# Altium project SPIDERBOT.PrjPcb
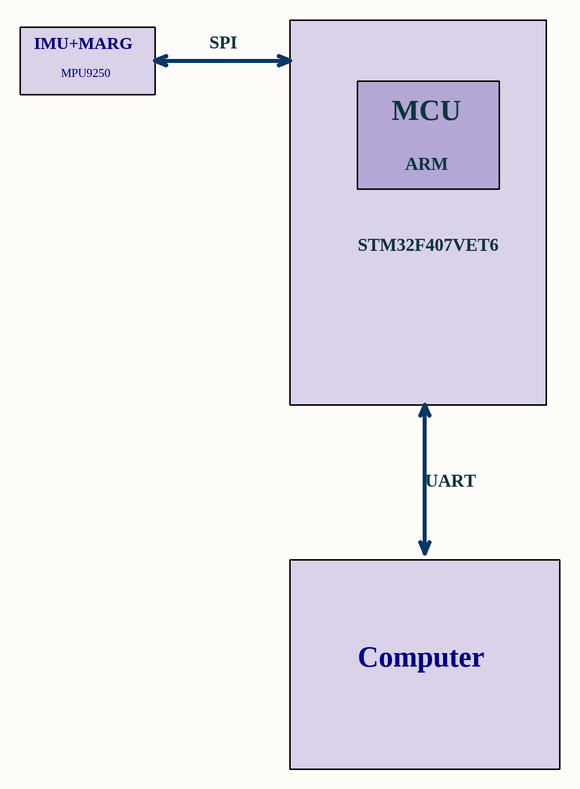
[diagram p0: Block_Diagram.SchDoc]
6 sheets, 25 parts. Net scope: flat (ports and power ports of the same name join across sheets).
Board file: Spiderbot.PcbDoc
Sheets:
  Block_Diagram.SchDoc
  PowerDiagram.SchDoc
  MCU.SchDoc
  PS2.SchDoc
  UART LORA.SchDoc
  Sheet1.SchDoc

## Sheet Block_Diagram.SchDoc
size A; SheetNumber: 1; SheetTotal: 7

### Notes on the sheet
- IMU+MARG
- MPU9250
- SPI
- MCU
- ARM
- STM32F407VET6
- UART
- Computer

## Sheet PowerDiagram.SchDoc
size A; SheetNumber: 2; SheetTotal: 5
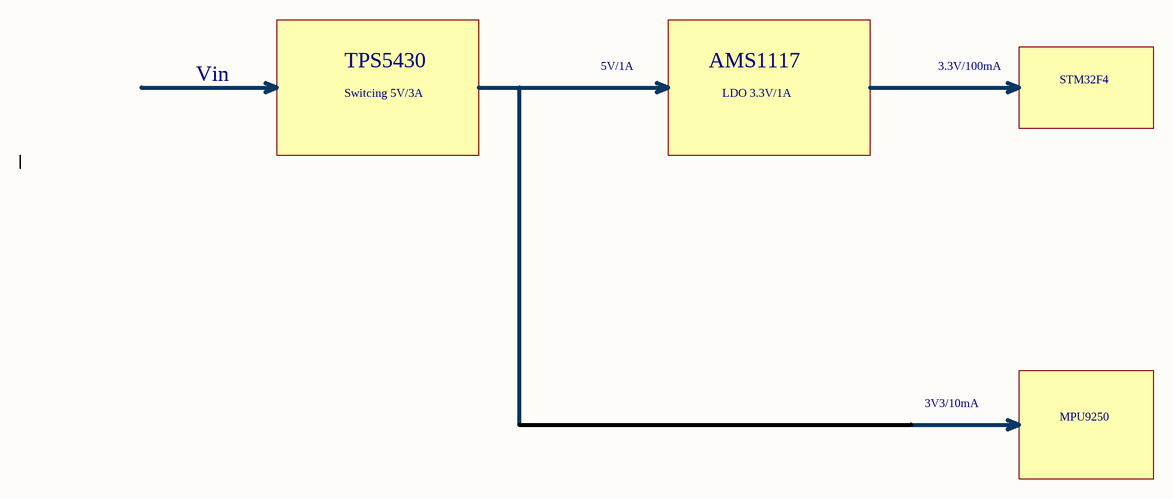
[diagram p1: PowerDiagram.SchDoc]

### Notes on the sheet
- Vin
- TPS5430
- Switcing 5V/3A
- 5V/1A
- AMS1117
- LDO 3.3V/1A
- 3.3V/100mA
- STM32F4
- 3V3/10mA
- MPU9250

## Sheet MCU.SchDoc
size A3; SheetNumber: 4; SheetTotal: 7
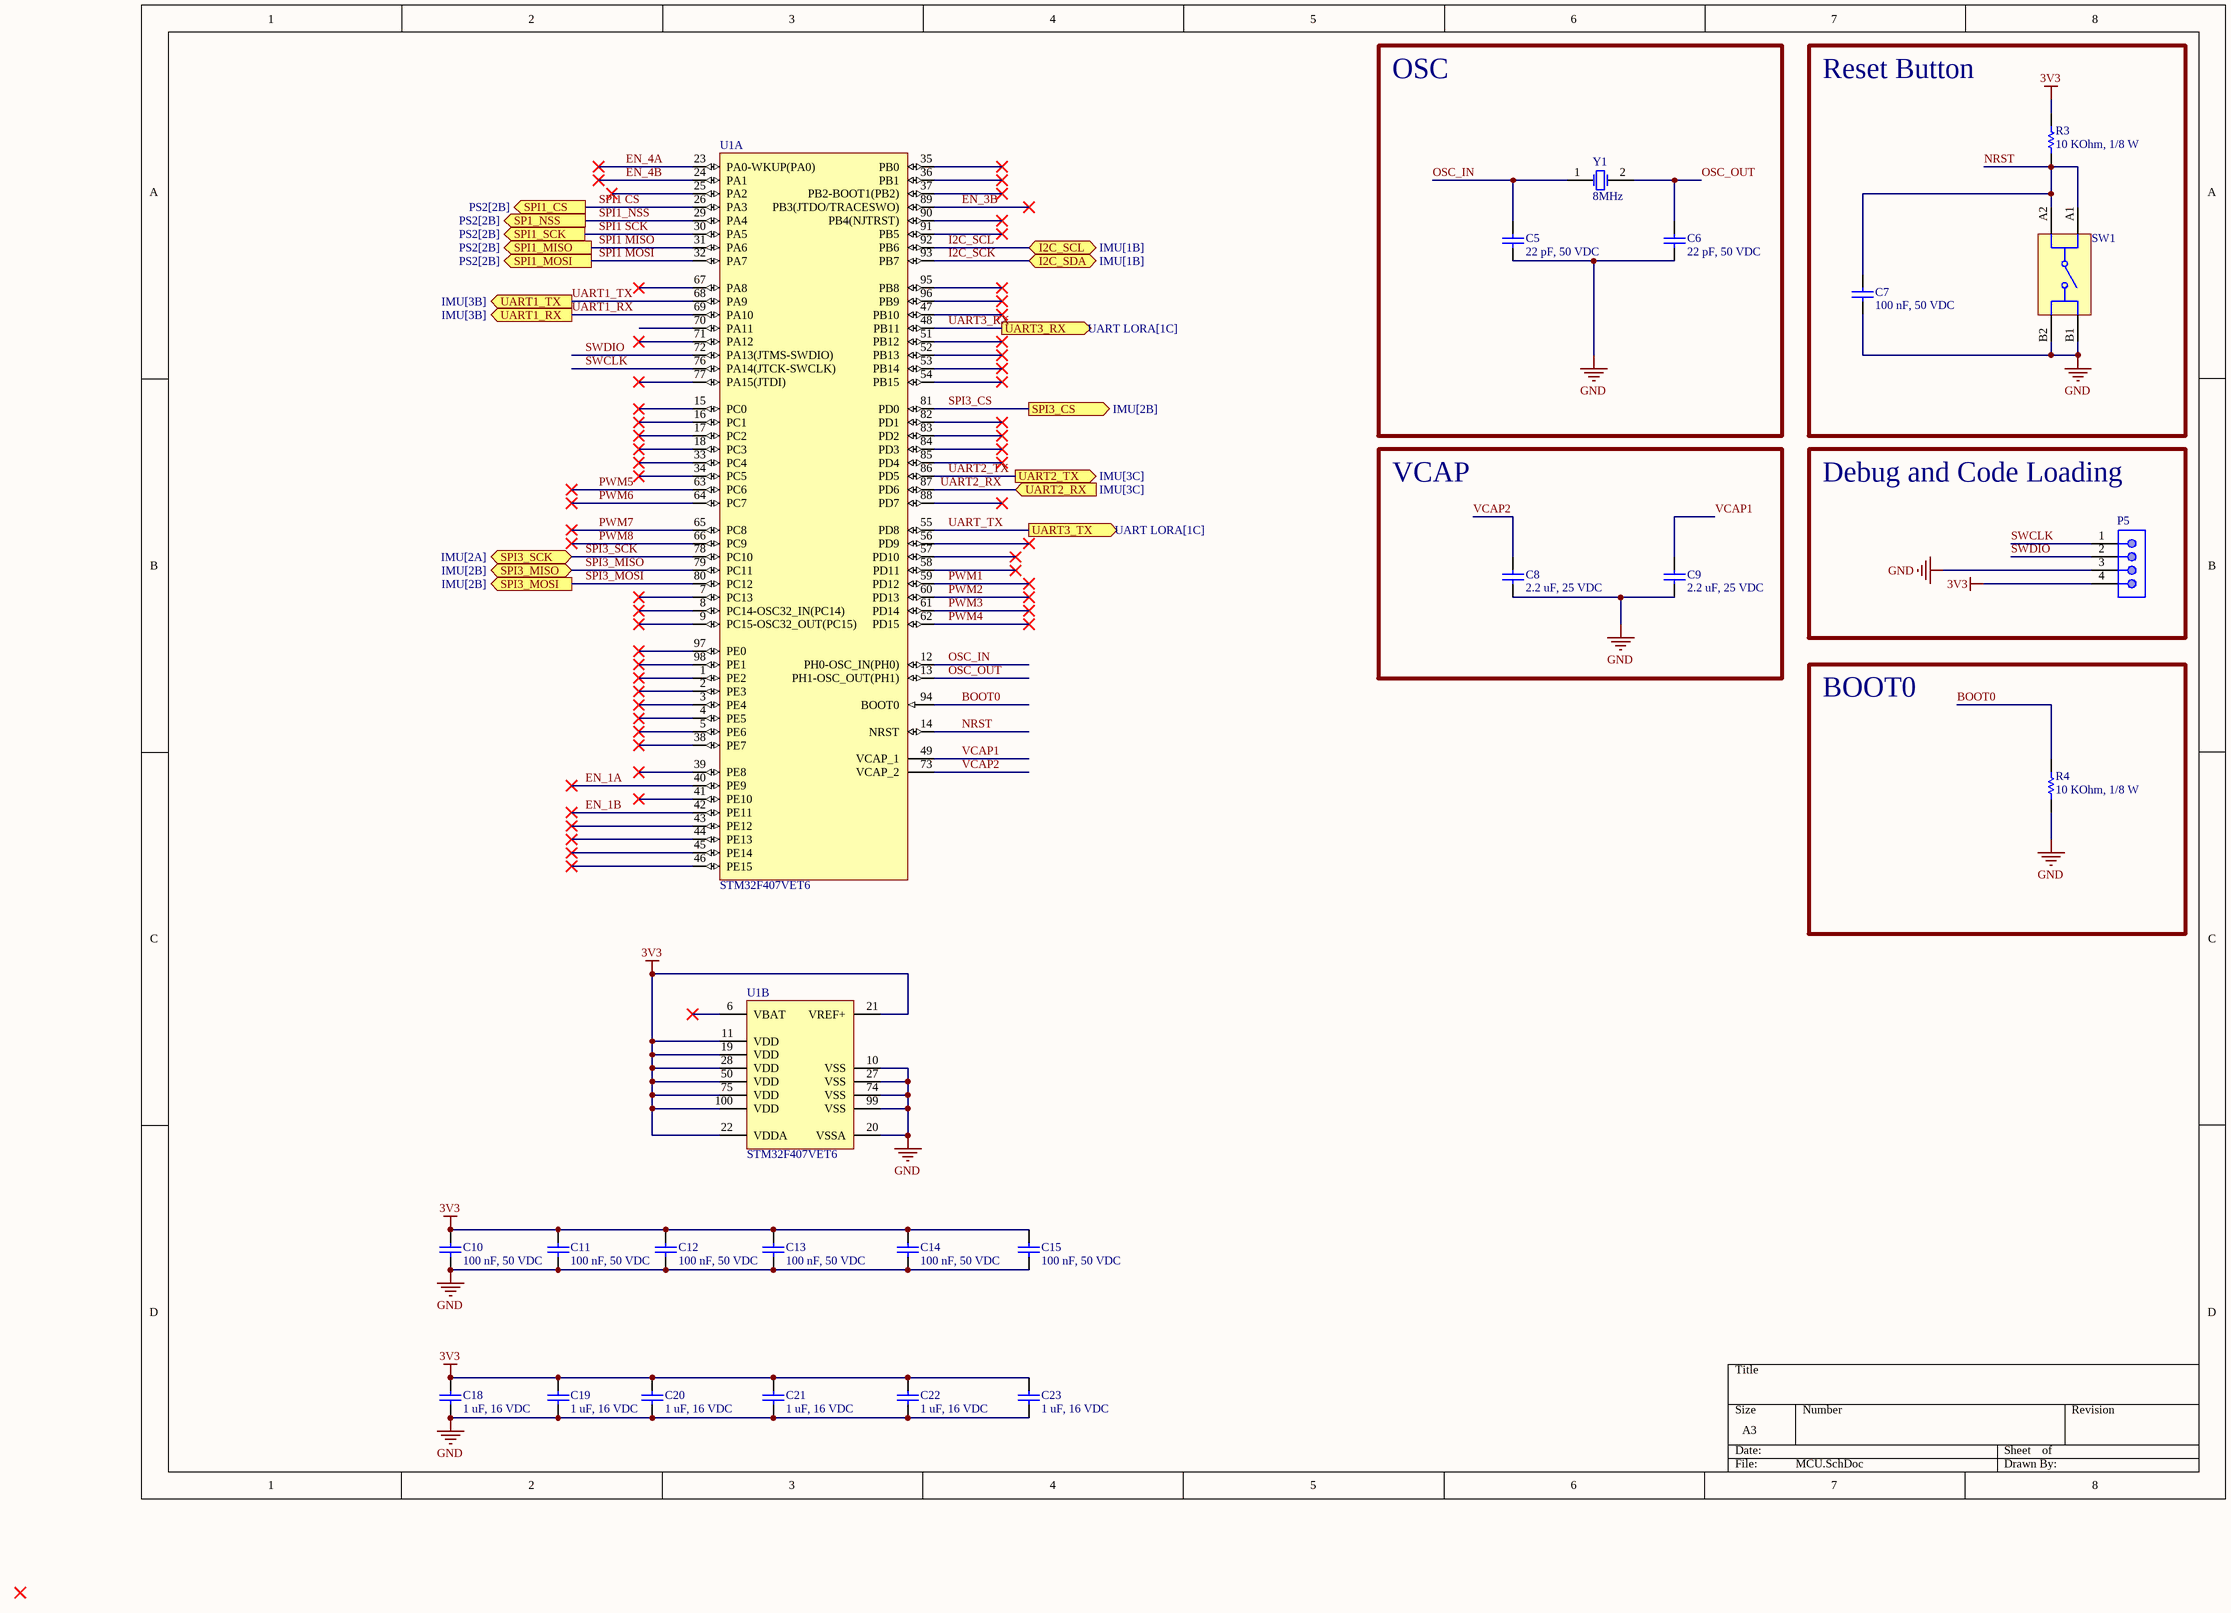
[diagram p2: MCU.SchDoc]

### Parts
C5  22 pF, 50 VDC  [CAP_0805]
C6  22 pF, 50 VDC  [CAP_0805]
C7  100 nF, 50 VDC  [CAP_0805]
C8  2.2 uF, 25 VDC  [CAP_0805]
C9  2.2 uF, 25 VDC  [CAP_0805]
C10  100 nF, 50 VDC  [CAP_0805]
C11  100 nF, 50 VDC  [CAP_0805]
C12  100 nF, 50 VDC  [CAP_0805]
C13  100 nF, 50 VDC  [CAP_0805]
C14  100 nF, 50 VDC  [CAP_0805]
C15  100 nF, 50 VDC  [CAP_0805]
C18  1 uF, 16 VDC  [CAP_0805]
C19  1 uF, 16 VDC  [CAP_0805]
C20  1 uF, 16 VDC  [CAP_0805]
C21  1 uF, 16 VDC  [CAP_0805]
C22  1 uF, 16 VDC  [CAP_0805]
C23  1 uF, 16 VDC  [CAP_0805]
P5  61300411121  [61300411121]  (value not drawn)
R3  10 KOhm, 1/8 W  [RESISTOR_0805]
R4  10 KOhm, 1/8 W  [RESISTOR_0805]
SW1  430483035816  [WS-TASV_L6W6H3.5_4304x30358x6]  (value not drawn)
U1  STM32F407VET6  [STM-LQFP100_V]  (parts A,B of 2)
Y1  8MHz  [WE-XTAL_HC49/4HSMX]

### Blocks framed on the sheet
OSC: C5 C6 Y1
Reset Button: C7 R3 SW1
VCAP: C8 C9
Debug and Code Loading: P5
BOOT0: R4

### Ports
I2C_SCL (bidir, see IMU[1B]), I2C_SDA (bidir, see IMU[1B]), SP1_NSS (out, see PS2[2B]), SPI1_CS (out, see PS2[2B]), SPI1_MISO (out, see PS2[2B]), SPI1_MOSI (out, see PS2[2B]), SPI1_SCK (out, see PS2[2B]), SPI3_CS (out, see IMU[2B]), SPI3_MISO (bidir, see IMU[2B]), SPI3_MOSI (out, see IMU[2B]), SPI3_SCK (bidir, see IMU[2A]), UART1_RX (out, see IMU[3B]), UART1_TX (out, see IMU[3B]), UART2_RX (in, see IMU[3C]), UART2_TX (out, see IMU[3C]), UART3_RX (out, see UART LORA[1C]), UART3_TX (out, see UART LORA[1C])

### Nets
3V3: C10.2 C11.2 C12.2 C13.2 C14.2 C15.2 C18.2 C19.2 C20.2 C21.2 C22.2 C23.2 P5.4 R3.2 U1.11(VDD) U1.19(VDD) U1.21(VREF+) U1.22(VDDA) U1.28(VDD) U1.50(VDD) U1.75(VDD) U1.100(VDD)
GND: C5.1 C6.1 C7.1 C8.1 C9.1 C10.1 C11.1 C12.1 C13.1 C14.1 C15.1 C18.1 C19.1 C20.1 C21.1 C22.1 C23.1 P5.3 R4.1 SW1.B1 SW1.B2 U1.10(VSS) U1.20(VSSA) U1.27(VSS) U1.74(VSS) U1.99(VSS)
BOOT0: R4.2 U1.94(BOOT0)
EN_1A: U1.40(PE9)
EN_1B: U1.42(PE11)
EN_3B: U1.89(PB3(JTDO/TRACESWO))
EN_4A: U1.23(PA0-WKUP(PA0))
EN_4B: U1.24(PA1)
I2C_SCK: U1.93(PB7) ; port I2C_SDA
I2C_SCL: U1.92(PB6) ; port I2C_SCL
NRST: C7.2 R3.1 SW1.A1 SW1.A2 U1.14(NRST)
OSC_IN: C5.2 U1.12(PH0-OSC_IN(PH0)) Y1.1(OSC1)
OSC_OUT: C6.2 U1.13(PH1-OSC_OUT(PH1)) Y1.2(OSC2)
PWM1: U1.59(PD12)
PWM2: U1.60(PD13)
PWM3: U1.61(PD14)
PWM4: U1.62(PD15)
PWM5: U1.63(PC6)
PWM6: U1.64(PC7)
PWM7: U1.65(PC8)
PWM8: U1.66(PC9)
SPI1 CS: U1.26(PA3) ; port SPI1_CS  [project net PS2_CS]
SPI1 MISO: U1.31(PA6) ; port SPI1_MISO
SPI1 MOSI: U1.32(PA7) ; port SPI1_MOSI
SPI1 SCK: U1.30(PA5) ; port SPI1_SCK
SPI1_NSS: U1.29(PA4) ; port SP1_NSS
SPI3_CS: U1.81(PD0) ; port SPI3_CS
SPI3_MISO: U1.79(PC11) ; port SPI3_MISO
SPI3_MOSI: U1.80(PC12) ; port SPI3_MOSI
SPI3_SCK: U1.78(PC10) ; port SPI3_SCK
SWCLK: P5.1 U1.76(PA14(JTCK-SWCLK))
SWDIO: P5.2 U1.72(PA13(JTMS-SWDIO))
UART1_RX: U1.69(PA10) ; port UART1_RX
UART1_TX: U1.68(PA9) ; port UART1_TX
UART2_RX: U1.87(PD6) ; port UART2_RX
UART2_TX: U1.86(PD5) ; port UART2_TX
UART3_RX: U1.48(PB11) ; port UART3_RX  [project net LC12S_TX]
UART_TX: U1.55(PD8) ; port UART3_TX  [project net LC12S_RX]
VCAP1: C9.2 U1.49(VCAP_1)
VCAP2: C8.2 U1.73(VCAP_2)

Not connected (* = marked no-connect by the designer): U1 1(PE2)* 2(PE3)* 3(PE4)* 4(PE5)* 5(PE6)* 6(VBAT)* 7(PC13)* 8(PC14-OSC32_IN(PC14))* 9(PC15-OSC32_OUT(PC15))* 15(PC0)* 16(PC1)* 17(PC2)* 18(PC3)* 25(PA2)* 33(PC4)* 34(PC5)* 35(PB0)* 36(PB1)* 37(PB2-BOOT1(PB2))* 38(PE7)* 39(PE8)* 41(PE10)* 43(PE12)* 44(PE13)* 45(PE14)* 46(PE15)* 47(PB10)* 51(PB12)* 52(PB13)* 53(PB14)* 54(PB15)* 56(PD9)* 57(PD10)* 58(PD11)* 67(PA8)* 70(PA11) 71(PA12)* 77(PA15(JTDI))* 82(PD1)* 83(PD2)* 84(PD3)* 85(PD4)* 88(PD7)* 90(PB4(NJTRST))* 91(PB5)* 95(PB8)* 96(PB9)* 97(PE0)* 98(PE1)*

### Library data of the parts
C5 C6 = 0108052231050: CAP, size 0805, 22 pF, 50 VDC; Manufacture Name: TDK; Manufacture SN: CGA4J2C0G1H223J125AA; Capacitance: 22 nF; Tolerance: +/-5%; Voltage Rating DC: 50 VDC; Value: 22 nF, 50 VDC; ComponentLink2Description: Datasheet; ComponentLink2URL: https://product.tdk.com/system/files/dam/doc/product/capacitor/ceramic/mlcc/catalog/mlcc_automotive_general_en.pdf?ref_disty=mouser; Operating Temperature: -55 to +125degC; Packaging: Tape and Reel; Mounting Technology: SMT; Size: 0805; Supplier 1 Name: Mouser; Supplier 1 SN: 810-CGA4J2C0G1H223J; Supplier 1 URL: https://www.mouser.vn/ProductDetail/TDK/CGA4J2C0G1H223J125AA?qs=NRhsANhppD%252B%2Fmt276RAXag%3D%3D&utm_source=mouser-refine-download&utm_medium=file&utm_campaign=CGA4J2C0G1H223J125AA&utm_content=TDK; Supplier 2 Name: Digi-Key; Supplier 2 SN: 445-6949-2-ND; Supplier 2 URL: https://www.digikey.com/en/products/detail/tdk-corporation/cga4j2c0g1h223j125aa/2672842; Supplier 3 Name: thegioiic; Supplier 3 SN: OEM; Supplier 3 URL: N/A
C7 = 0108051541050: CAP, size 0805, 100 nF, 50 VDC; Manufacture Name: TDK; Manufacture SN: CGA4J2X7R1H154K125AD; Capacitance: 150 nF; Tolerance: +/-10%; Voltage Rating DC: 50 VDC; Value: 150 nF, 50 VDC; ComponentLink2Description: Datasheet; ComponentLink2URL: https://product.tdk.com/system/files/dam/doc/product/capacitor/ceramic/mlcc/catalog/mlcc_automotive_epoxy_en.pdf?ref_disty=mouser; Operating Temperature: -55 to +125degC; Packaging: Tape and Reel; Mounting Technology: SMT; Size: 0805; Supplier 1 Name: Mouser; Supplier 1 SN: 810-CGA4J2X7R1H154KD; Supplier 1 URL: https://www.mouser.vn/ProductDetail/TDK/CGA4J2X7R1H154K125AD?qs=xLDY6iXSiQYlxmVq9lRXDA%3D%3D&utm_source=mouser-refine-download&utm_medium=file&utm_campaign=CGA4J2X7R1H154K125AD&utm_content=TDK; Supplier 2 Name: Digi-Key; Supplier 2 SN: 445-9929-2-ND; Supplier 2 URL: https://www.digikey.com/en/products/detail/tdk-corporation/cga4j2x7r1h154k125ad/3933662; Supplier 3 Name: thegioiic; Supplier 3 SN: OEM; Supplier 3 URL: N/A
C8 C9 = 0108052251025: CAP, size 0805, 2.2 uF, 25 VDC; Manufacture Name: TDK; Manufacture SN: CGA4J3X7R1E225K125AD; Capacitance: 2.2 uF; Tolerance: +/-10%; Voltage Rating DC: 25 VDC; ComponentLink2Description: Datasheet; ComponentLink2URL: https://product.tdk.com/system/files/dam/doc/product/capacitor/ceramic/mlcc/catalog/mlcc_automotive_epoxy_en.pdf?ref_disty=mouser; Operating Temperature: -55 to +125degC; Packaging: Tape and Reel; Mounting Technology: SMT; Size: 0805; Supplier 1 Name: Mouser; Supplier 1 SN: 810-CGA4J3X7R1E225KD; Supplier 1 URL: https://www.mouser.vn/ProductDetail/TDK/CGA4J3X7R1E225K125AD?qs=xLDY6iXSiQZ6drRfaPQTzQ%3D%3D&utm_source=mouser-refine-download&utm_medium=file&utm_campaign=CGA4J3X7R1E225K125AD&utm_content=TDK; Supplier 2 Name: Digi-Key; Supplier 2 SN: 445-9923-2-ND; Supplier 2 URL: https://www.digikey.com/en/products/detail/tdk-corporation/cga4j3x7r1e225k125ad/3933656; Supplier 3 Name: thegioiic; Supplier 3 SN: OEM; Supplier 3 URL: N/A; Value: 2.2 uF, 25 VDC
C10-C15 = 0108051031050: CAP, size 0805, 100 nF, 50 VDC; Manufacture Name: TDK; Manufacture SN: CGA4C2C0G1H103J060AA; Capacitance: 10 nF; Tolerance: +/-5%; Voltage Rating DC: 50 VDC; Value: 10 nF, 50 VDC; ComponentLink2Description: Datasheet; ComponentLink2URL: https://product.tdk.com/system/files/dam/doc/product/capacitor/ceramic/mlcc/catalog/mlcc_automotive_general_en.pdf?ref_disty=mouser; Operating Temperature: -55 to +125degC; Packaging: Tape and Reel; Mounting Technology: SMT; Size: 0805; Supplier 1 Name: Mouser; Supplier 1 SN: 810-CGA4C2C0G1H103J; Supplier 1 URL: https://www.mouser.vn/ProductDetail/TDK/CGA4C2C0G1H103J060AA?qs=FxQuwy19cyC9M6v0nMqjhA%3D%3D&utm_source=mouser-refine-download&utm_medium=file&utm_campaign=CGA4C2C0G1H103J060AA&utm_content=TDK; Supplier 2 Name: Digi-Key; Supplier 2 SN: 445-6947-2-ND; Supplier 2 URL: https://www.digikey.com/en/products/detail/tdk-corporation/cga4c2c0g1h103j060aa/2672840; Supplier 3 Name: thegioiic; Supplier 3 SN: OEM; Supplier 3 URL: N/A
C18-C23 = 0108051051016: CAP, size 0805, 1 uF, 16 VDC; Manufacture Name: TDK; Manufacture SN: CGA4J2X7R1C105K125AA; Capacitance: 1 uF; Tolerance: +/-10%; Voltage Rating DC: 16 VDC; ComponentLink2Description: Datasheet; ComponentLink2URL: https://product.tdk.com/system/files/dam/doc/product/capacitor/ceramic/mlcc/catalog/mlcc_automotive_general_en.pdf?ref_disty=mouser; Operating Temperature: -55 to +125degC; Packaging: Tape and Reel; Mounting Technology: SMT; Size: 0805; Supplier 1 Name: Mouser; Supplier 1 SN: 810-CGA4J2X7R1C105K; Supplier 1 URL: https://www.mouser.vn/ProductDetail/TDK/CGA4J2X7R1C105K125AA?qs=NRhsANhppD8sFjo%252B1TQuCQ%3D%3D&utm_source=mouser-refine-download&utm_medium=file&utm_campaign=CGA4J2X7R1C105K125AA&utm_content=TDK; Supplier 2 Name: Digi-Key; Supplier 2 SN: 445-5689-2-ND; Supplier 2 URL: https://www.digikey.com/en/products/detail/tdk-corporation/cga4j2x7r1c105k125aa/2443167; Supplier 3 Name: thegioiic; Supplier 3 SN: OEM; Supplier 3 URL: N/A; Value: 1 uF, 16 VDC
P5 = 61300411121: WR-PHD Pin Header, THT, pitch 2.54mm, Single Row, Vertical, 4p; Manufacturer: Wurth Elektronik; Pin Number: 4; Rated Current: 3A; Working Voltage: 250VAC; Withstanding Voltage: 500VAC; Contact Resistance: 20mOhm; Supply Name 1: Mouser; ComponentLink1Description: Manufacturer; ComponentLink1URL: http://www.we-online.de; ComponentLink2Description: Datasheet; ComponentLink2URL: https://www.we-online.com/catalog/datasheet/61300411121.pdf; Manufacturer Part Number: 61300411121; Published Date: May 2020; Pitch: 2.54mm; Operating Temperature: -40 to +105degC; Mounting Technology: THT; Packaging: Bag; Gender: Pin Header; Row Number: Single; Orientation: Vertical; ComponentLink3Description: Global Supply; ComponentLink3URL: https://www.we-online.com/en/components/products/PHD_2_54_THT_PIN_HEADER_6130XX11121?sq=61300411121#61300411121; ComponentLink4Description: Global Supply; ComponentLink4URL: https://www.mouser.vn/ProductDetail/Wurth-Elektronik/61300411121?qs=PhR8RmCirEYQcLLqXD8rAA%3D%3D; Supplier 1 Name: Mouser; Supplier 1 SN: 710-61300311121; Supplier 1 URL: https://www.mouser.vn/ProductDetail/Wurth-Elektronik/61300311121?qs=PhR8RmCirEYxRWFJzNKsUw%3D%3D; Supplier 2 Name: Digi-Key; Supplier 2 SN: N/A; Supplier 2 URL: N/A; Supplier 3 Name: thegioiic; Supplier 3 SN: N/A; Supplier 3 URL: N/A
R3 R4 = 0008051031: RES, size 0805, 10 KOhm, 1/8 W; Resistance tolerance: +/-1%; Rated Power: 1/8 W; Resistance: 10 KOhm; Size: 0805; Mounting Technology: SMT; Supplier 1 Name: Mouser; Supplier 1 SN: N/A; Supplier 1 URL: N/A; Supplier 2 Name: Digi-Key; Supplier 2 SN: N/A; Supplier 2 URL: N/A; Supplier 3 Name: Thegioiic; Supplier 3 SN: N/A; Supplier 3 URL: https://www.thegioiic.com/dien-tro-1-kohm-0805-1; Manufacture  Name: N/A; Manufacture  SN: N/A; Value: 10 KOhm, 1/8 W; ComponentLink1Description: Datasheet link; ComponentLink1URL: N/A; ComponentLink2Description: Supplier 1 URL; ComponentLink2URL: N/A; ComponentLink3Description: Supplier 2 URL; ComponentLink3URL: N/A; ComponentLink4Description: Supplier 3 URL; ComponentLink4URL: https://www.thegioiic.com/dien-tro-1-kohm-0805-1
SW1 = 430483035816: WS-TASV J-Bend SMT Washable Tact Switch, 12VDC, 50mA, 160g, height 3.5mm; Manufacturer: Wurth Elektronik; Rated Voltage: 12V; Washable: Yes; Actuator Color: Black; Electrical Life: 1000000Cycles; ComponentLink1Description: Manufacturer Link; ComponentLink1URL: http://www.we-online.de; ComponentLink2Description: Datasheet; ComponentLink2URL: https://www.we-online.com/catalog/datasheet/430483035816.pdf; Manufacturer Part Number: 430483035816; Contact Material: Stainless Steel; Mounting Technology: SMT; Contact Plating: Silver; Operation Force: 160g; Packaging: Tape and Reel; Terminal Material: Copper Alloy; Rated Current: 50mA; Terminal Plating: Silver; Height: 3.5mm; Length: 6mm; Operating Temperature max.: 85C; Operating Temperature min.: -40C; Width: 6mm
U1 = CMP-0243-00016-3: ARM Cortex-M4 32-bit MCU+FPU, 210 DMIPS, 512 kB Flash, 192 kB Internal RAM, 82 I/Os, 100-pin LQFP, -40 to 85 degC, Tray; Manufacturer: STMicroelectronics; Supply Voltage(Vcc) max (V): 3.6; Supply Voltage(Vcc) min (V): 1.8; I/Os (High Current): 82; FLASH Size (Prog) (kB): 512; Operating Frequency(F) (Processor speed) (MHz): 168; D/A Converter: 2x12-bit; Internal RAM Size (kB): 192; PackageReference: LQFP100; Core: ARM Cortex-M4; ComponentLink1URL: http://www.st.com/web/en/home.html; ComponentLink1Description: Manufacturer URL; DatasheetVersion: Rev. 4; Packing: Tray; Mounting Technology: Surface Mount; ComponentLink2Description: Datasheet; ComponentLink2URL: http://www.st.com/st-web-ui/static/active/en/resource/technical/document/datasheet/DM00037051.pdf; ComponentLink3Description: Package Specification; PartNumber: STM32F407VET6; PackageVersion: Rev. 1, 06/2013; PackageDescription: 100-Pin Low Profile Quad Flat Package, 14 x 14 mm Body, 0.5 mm Pitch; ComponentLink3URL: http://www.st.com/st-web-ui/static/active/en/resource/technical/document/data_brief/DM00071938.pdf
Y1 = 071105086016: WE-XTAL Quartz Crystal, SMT, HC49/4HSMX, 8MHz, +/-30ppm; Manufacturer Part Number: 830003151; Manufacturer: Wurth Elektronik; Frequency Stability: +/-50ppm; Load Capacitance: 16pF; ComponentLink2Description: Supplier 1 URL; ComponentLink2URL: https://www.mouser.com/ProductDetail/Wurth-Elektronik/830003151?qs=2WXlatMagcHisY7XHApyYg%3D%3D; Operating Temperature: -10 to +60degC; Size: HC49/4HSMX; Frequency: 8MHz; Frequency Tolerance: +/-30ppm; Mounting Technology: SMT; Supplier 3 Name: thegioiic; Supplier 3 SN: N/A; Supplier 3 URL: https://www.thegioiic.com/thach-anh-8mhz-2-chan-smd-hc49-s; ComponentLink1Description: Datasheet link; ComponentLink1URL: https://katalog.we-online.com/pbs/datasheet/830003151.pdf; ComponentLink3Description: Supplier 2 URL; ComponentLink3URL: https://www.digikey.com/en/products/detail/w%C3%BCrth-elektronik/830003151/13979296; ComponentLink4Description: Supplier 3 URL; ComponentLink4URL: https://www.thegioiic.com/thach-anh-8mhz-2-chan-smd-hc49-s; Supplier 1 Name: Mouser; Supplier 1 SN: 710-830003151; Supplier 1 URL: https://www.mouser.com/ProductDetail/Wurth-Elektronik/830003151?qs=2WXlatMagcHisY7XHApyYg%3D%3D; Supplier 2 Name: Digi-Key; Supplier 2 SN: 732-830003151TR-ND; Supplier 2 URL: https://www.digikey.com/en/products/detail/w%C3%BCrth-elektronik/830003151/13979296; Value: 8MHz

## Sheet PS2.SchDoc
size A; SheetNumber: 6; SheetTotal: 7
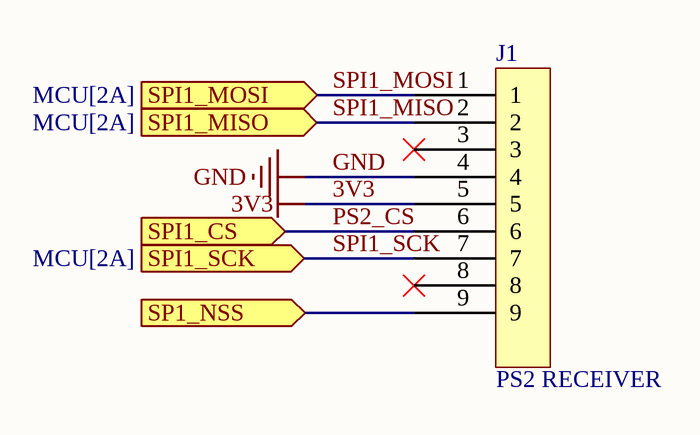
[diagram p3: PS2.SchDoc]

### Parts
J1  PS2 RECEIVER  [Female_Header_10]

### Ports
SP1_NSS (in), SPI1_CS (in), SPI1_MISO (in, see MCU[2A]), SPI1_MOSI (in, see MCU[2A]), SPI1_SCK (in, see MCU[2A])

### Nets
3V3: J1.5
GND: J1.4
PS2_CS: J1.6 ; port SPI1_CS
SPI1_MISO: J1.2 ; port SPI1_MISO  [project net SPI1 MISO]
SPI1_MOSI: J1.1 ; port SPI1_MOSI  [project net SPI1 MOSI]
SPI1_NSS: J1.9 ; port SP1_NSS
SPI1_SCK: J1.7 ; port SPI1_SCK  [project net SPI1 SCK]

Not connected (* = marked no-connect by the designer): J1 3* 8*

### Library data of the parts
J1 = M20-7821046: HARWIN - M20-7821046 - Board-To-Board Connector, M20 Series, Through Hole, Receptacle, 10, 2.54 mm, Tin Plated Contacts; Number of Contacts: 10; Connector Type: Receptacle,Socket; Insulation Resistance: 1MR; Max Current Rating: 3A; Contact Resistance: 20mR; Mating Cycles: 50; Pitch: 2.54mm; Hole Diameter: 0.8mm; Manufacturer: Harwin; Manufacturer Part Number: M20-7821046; RoHS: Yes; Category: Headers and Wire Housings; Stock 1: 97; Pricing 1: 1=1,28000, 10=1,12200, 100=0,96800, 500=0,79200, 1000=0,70400, 5000=0,61600, 10000=0,58520 (USD); Mount: Through Hole; Case/Package: SIL; Housing Color: Black; Color: Black; Contact Plating: Tin; Contact Material: Bronze; Housing Material: Polyamide; Min Operating Temperature: -40°C; Max Operating Temperature: 105°C; Termination: Solder; Number of Rows: 1; Orientation: Straight; Number of Positions: 10; Gender: Receptacle; Packaging: Rail/Tube; Contact Gender: Female; Package Quantity: 23; Current Rating: 3A; Length: 25.8mm; Depth: 2.5mm; Lead Pitch: 2.54mm; Radiation Hardening: No; REACH SVHC: No SVHC; ComponentLink1URL: https://datasheet.ciiva.com/26899/getdatasheetpartid-559226-26899379.pdf?src-supplier=Verical; ComponentLink1Description: https://datasheet.ciiva.com/26899/getdatasheetpartid-559226-26899379.pdf?src-supplier=Verical; ComponentLink2URL: https://datasheet.ciiva.com/11753/0900766b80dc1d2b-11753869.pdf?src-supplier=RSComponents; ComponentLink2Description: https://datasheet.ciiva.com/11753/0900766b80dc1d2b-11753869.pdf?src-supplier=RSComponents; ComponentLink3URL: https://datasheet.ciiva.com/6785/m20-782-6785605.pdf?src-supplier=Digi-Key; ComponentLink3Description: https://datasheet.ciiva.com/6785/m20-782-6785605.pdf?src-supplier=Digi-Key; ComponentLink4URL: https://datasheet.ciiva.com/10151/m20-782-10151366.pdf?src-supplier=Avnet; ComponentLink4Description: https://datasheet.ciiva.com/10151/m20-782-10151366.pdf?src-supplier=Avnet; ComponentLink5URL: https://datasheet.ciiva.com/16732/m20-782-16732152.pdf?src-supplier=Avnet+Europe; ComponentLink5Description: https://datasheet.ciiva.com/16732/m20-782-16732152.pdf?src-supplier=Avnet+Europe; Supplier 1: Digi-Key; Supplier Part Number 1: 952-1847-ND

## Sheet UART LORA.SchDoc
size A; SheetNumber: 7; SheetTotal: 7
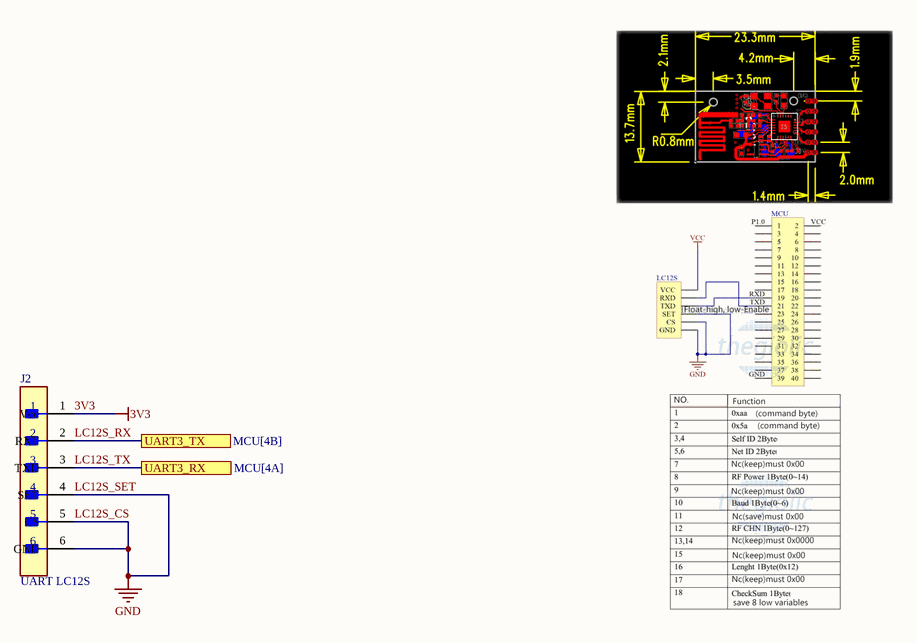
[diagram p4: UART LORA.SchDoc]

### Parts
J2  UART LC12S  [FP-22-28-4060-MFG]

### Ports
UART3_RX (see MCU[4A]), UART3_TX (see MCU[4B])

### Nets
3V3: J2.1(Vcc)
GND: J2.4(SET) J2.5(CS) J2.6(GND)  [also labelled LC12S_CS, LC12S_SET]
LC12S_RX: J2.2(RXT) ; port UART3_TX
LC12S_TX: J2.3(TXD) ; port UART3_RX

### Library data of the parts
J2 = CMP-002-00071-1: KK 254 Breakaway Header, Vertical, 6 Circuits, Tin (Sn) Plating, Mating Pin Length 6.09mm; Voltage Rating: 250V; Gender: Male; Min Operating Temperature: 0°C; Mounting Technology: Through Hole; Max Operating Temperature: 75°C; RoHS Compliant: Yes

## Sheet Sheet1.SchDoc
size A; SheetNumber: 8; SheetTotal: 8
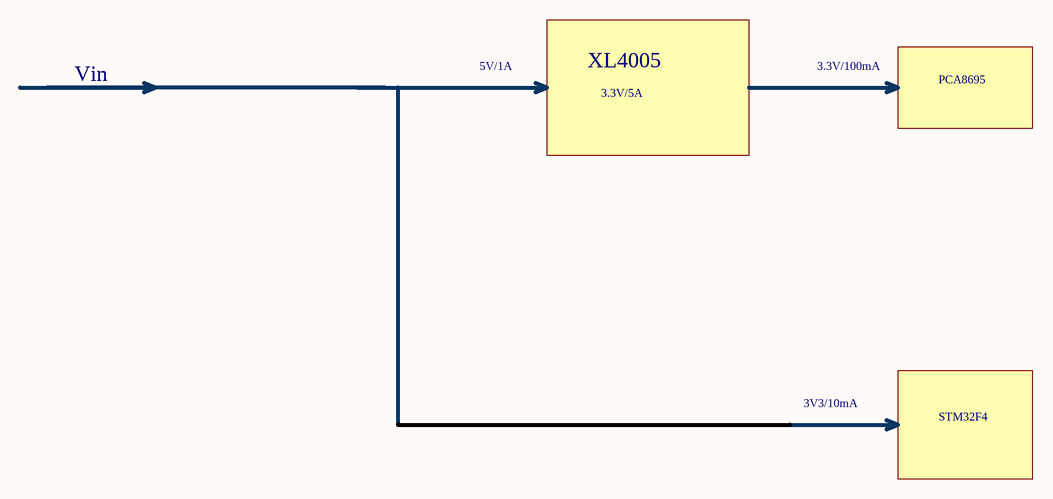
[diagram p5: Sheet1.SchDoc]

### Notes on the sheet
- Vin
- 5V/1A
- XL4005
- 3.3V/5A
- 3.3V/100mA
- PCA8695
- 3V3/10mA
- STM32F4

## Nets that join several sheets
3V3: MCU (22 pins), PS2 (J1.5), UART LORA (J2.1)
GND: MCU (26 pins), PS2 (J1.4), UART LORA (J2.4 J2.5 J2.6)
LC12S_RX: MCU (U1.55), UART LORA (J2.2)
LC12S_TX: MCU (U1.48), UART LORA (J2.3)
PS2_CS: MCU (U1.26), PS2 (J1.6)
SPI1 MISO: MCU (U1.31), PS2 (J1.2)
SPI1 MOSI: MCU (U1.32), PS2 (J1.1)
SPI1 SCK: MCU (U1.30), PS2 (J1.7)
SPI1_NSS: MCU (U1.29), PS2 (J1.9)